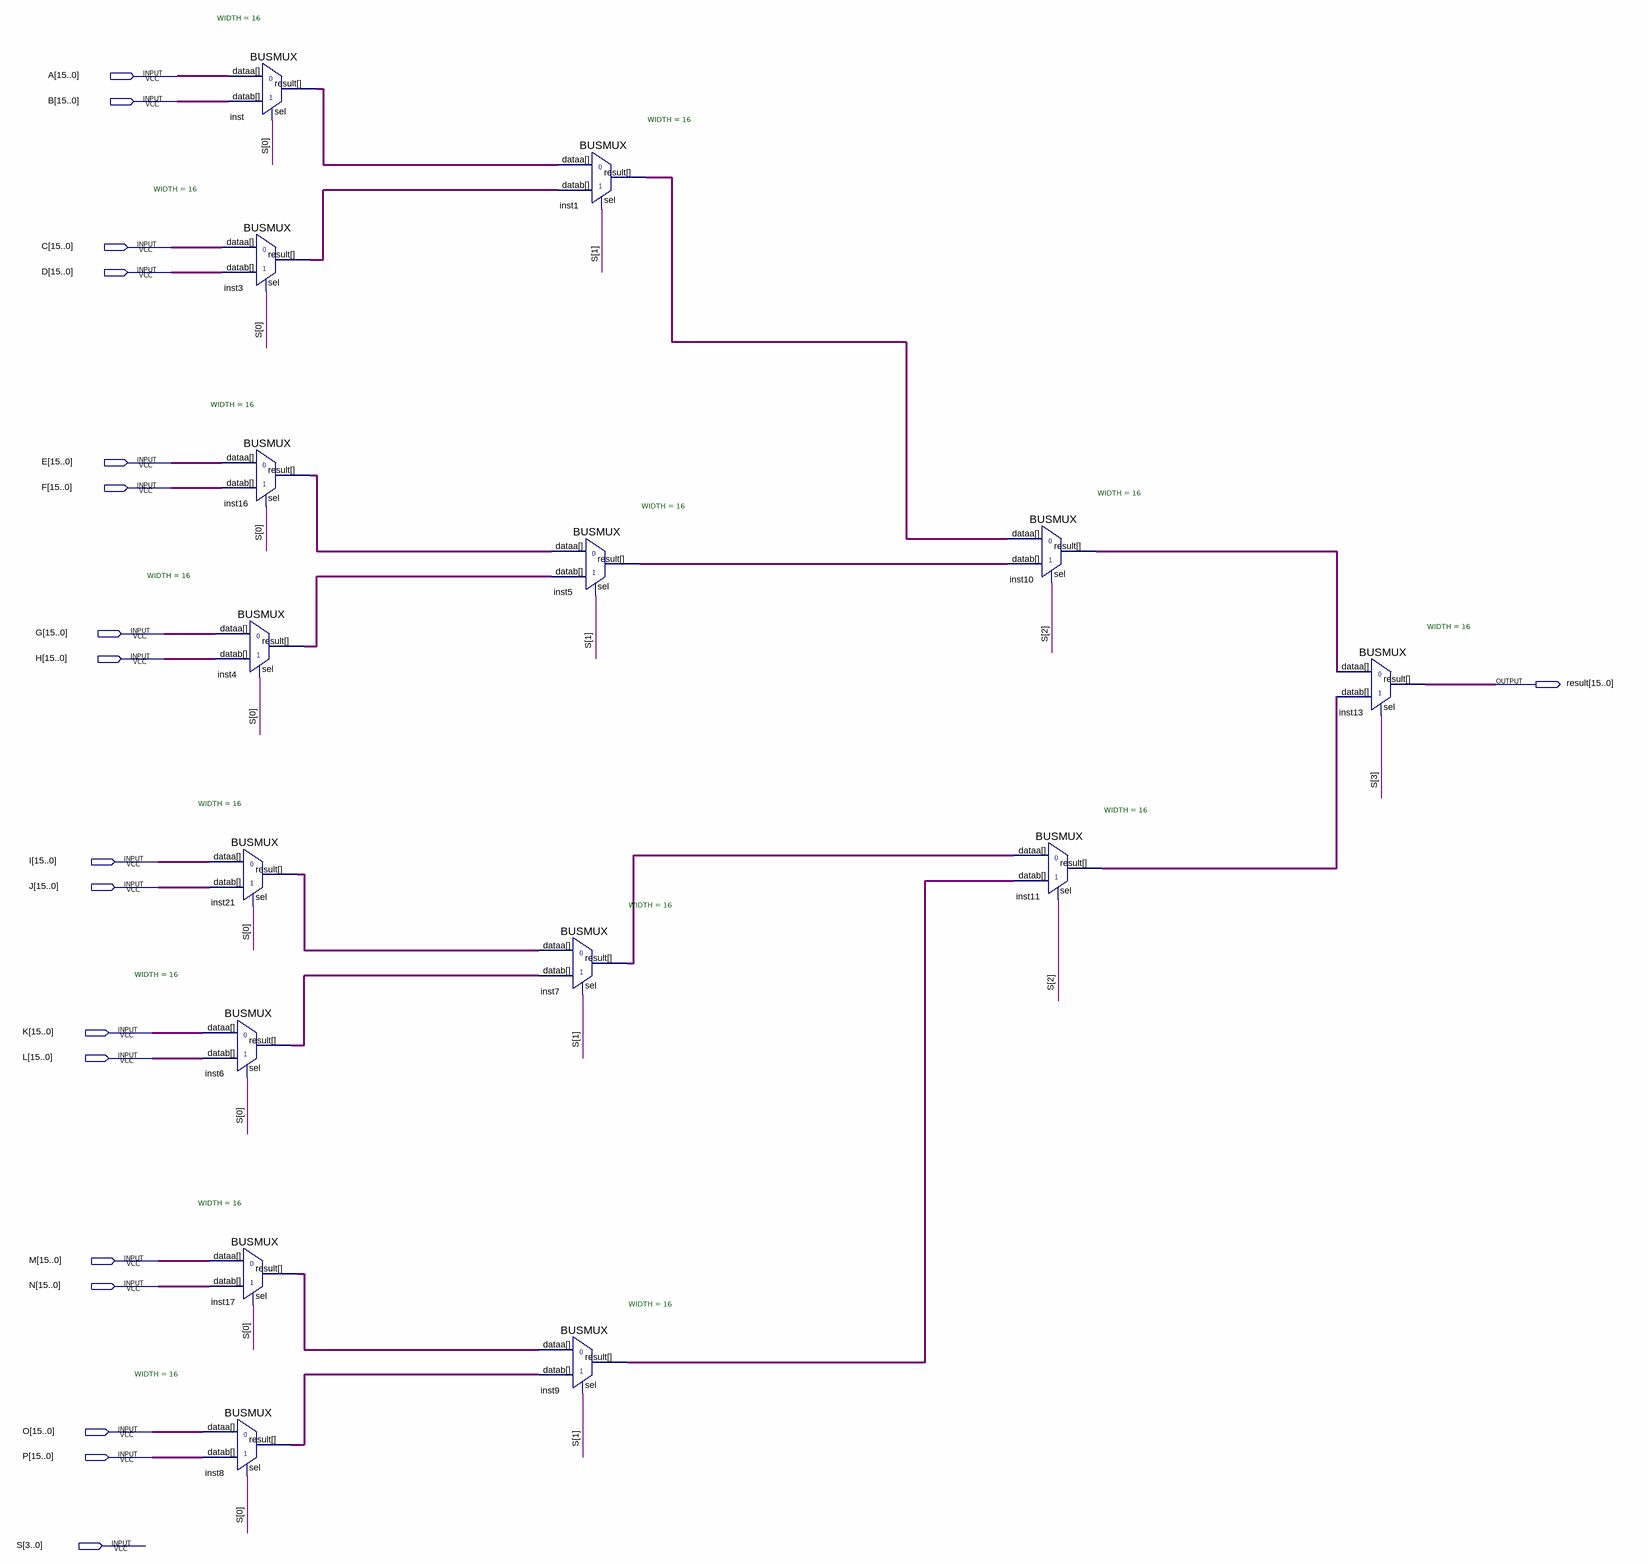
[diagram p0: schematic sheet]
// Quartus schematic mux16-1.bdf as structural Verilog: 15 symbols, 18 pins
module \mux16-1  (
  input  [15:0] A,
  input  [15:0] B,
  input  [15:0] C,
  input  [15:0] D,
  input  [15:0] E,
  input  [15:0] F,
  input  [15:0] G,
  input  [15:0] H,
  input  [15:0] I,
  input  [15:0] J,
  input  [15:0] K,
  input  [15:0] L,
  input  [15:0] M,
  input  [15:0] N,
  input  [15:0] O,
  input  [15:0] P,
  input  [3:0] S,
  output [15:0] result
);

  wire [15:0] inst1_result, inst3_result, inst4_result, inst5_result, inst6_result, inst7_result,
       inst8_result, inst9_result, inst10_result, inst11_result, inst16_result, inst17_result, inst21_result,
       inst_result;

  BUSMUX #(.WIDTH(16)) inst (.datab(B), .sel(S[0]), .dataa(A), .result(inst_result));
  BUSMUX #(.WIDTH(16)) inst3 (.datab(D), .sel(S[0]), .dataa(C), .result(inst3_result));
  BUSMUX #(.WIDTH(16)) inst16 (.datab(F), .sel(S[0]), .dataa(E), .result(inst16_result));
  BUSMUX #(.WIDTH(16)) inst4 (.datab(H), .sel(S[0]), .dataa(G), .result(inst4_result));
  BUSMUX #(.WIDTH(16)) inst21 (.datab(J), .sel(S[0]), .dataa(I), .result(inst21_result));
  BUSMUX #(.WIDTH(16)) inst6 (.datab(L), .sel(S[0]), .dataa(K), .result(inst6_result));
  BUSMUX #(.WIDTH(16)) inst17 (.datab(N), .sel(S[0]), .dataa(M), .result(inst17_result));
  BUSMUX #(.WIDTH(16)) inst8 (.datab(P), .sel(S[0]), .dataa(O), .result(inst8_result));
  BUSMUX #(.WIDTH(16)) inst7 (.datab(inst6_result), .sel(S[1]), .dataa(inst21_result), .result(inst7_result));
  BUSMUX #(.WIDTH(16)) inst9 (.datab(inst8_result), .sel(S[1]), .dataa(inst17_result), .result(inst9_result));
  BUSMUX #(.WIDTH(16)) inst1 (.datab(inst3_result), .sel(S[1]), .dataa(inst_result), .result(inst1_result));
  BUSMUX #(.WIDTH(16)) inst5 (.datab(inst4_result), .sel(S[1]), .dataa(inst16_result), .result(inst5_result));
  BUSMUX #(.WIDTH(16)) inst10 (.datab(inst5_result), .sel(S[2]), .dataa(inst1_result), .result(inst10_result));
  BUSMUX #(.WIDTH(16)) inst11 (.datab(inst9_result), .sel(S[2]), .dataa(inst7_result), .result(inst11_result));
  BUSMUX #(.WIDTH(16)) inst13 (.datab(inst11_result), .sel(S[3]), .dataa(inst10_result), .result(result));
endmodule
